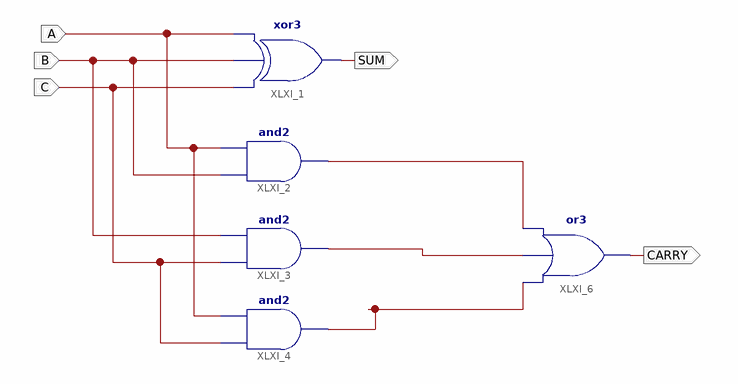
[diagram p0: schematic sheet 1]
// Xilinx ISE schematic amada.sch (artix7) as structural Verilog: 5 symbols, 5 ports
module amada (
  input  B,
  input  A,
  input  C,
  output SUM,
  output CARRY
);

  wire XLXN_7, XLXN_8, XLXN_15;

  xor XLXI_1 (SUM, C, B, A);
  and XLXI_2 (XLXN_7, B, A);
  and XLXI_3 (XLXN_8, C, B);
  and XLXI_4 (XLXN_15, C, A);
  or XLXI_6 (CARRY, XLXN_15, XLXN_8, XLXN_7);
endmodule
